# EAGLE schematic smartwatch-top (EAGLE 9.5.1)
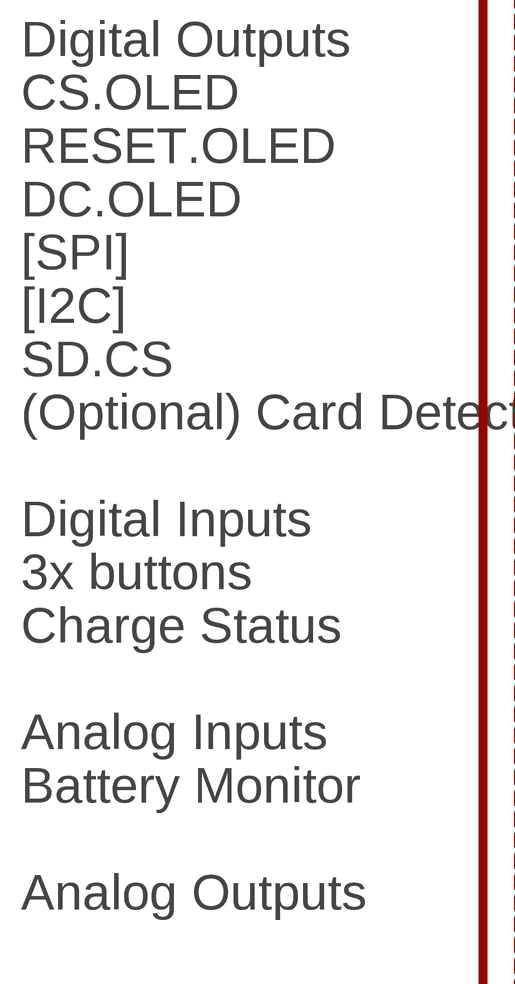
[diagram p0: schematic, sheet 1, part 1 of 2]
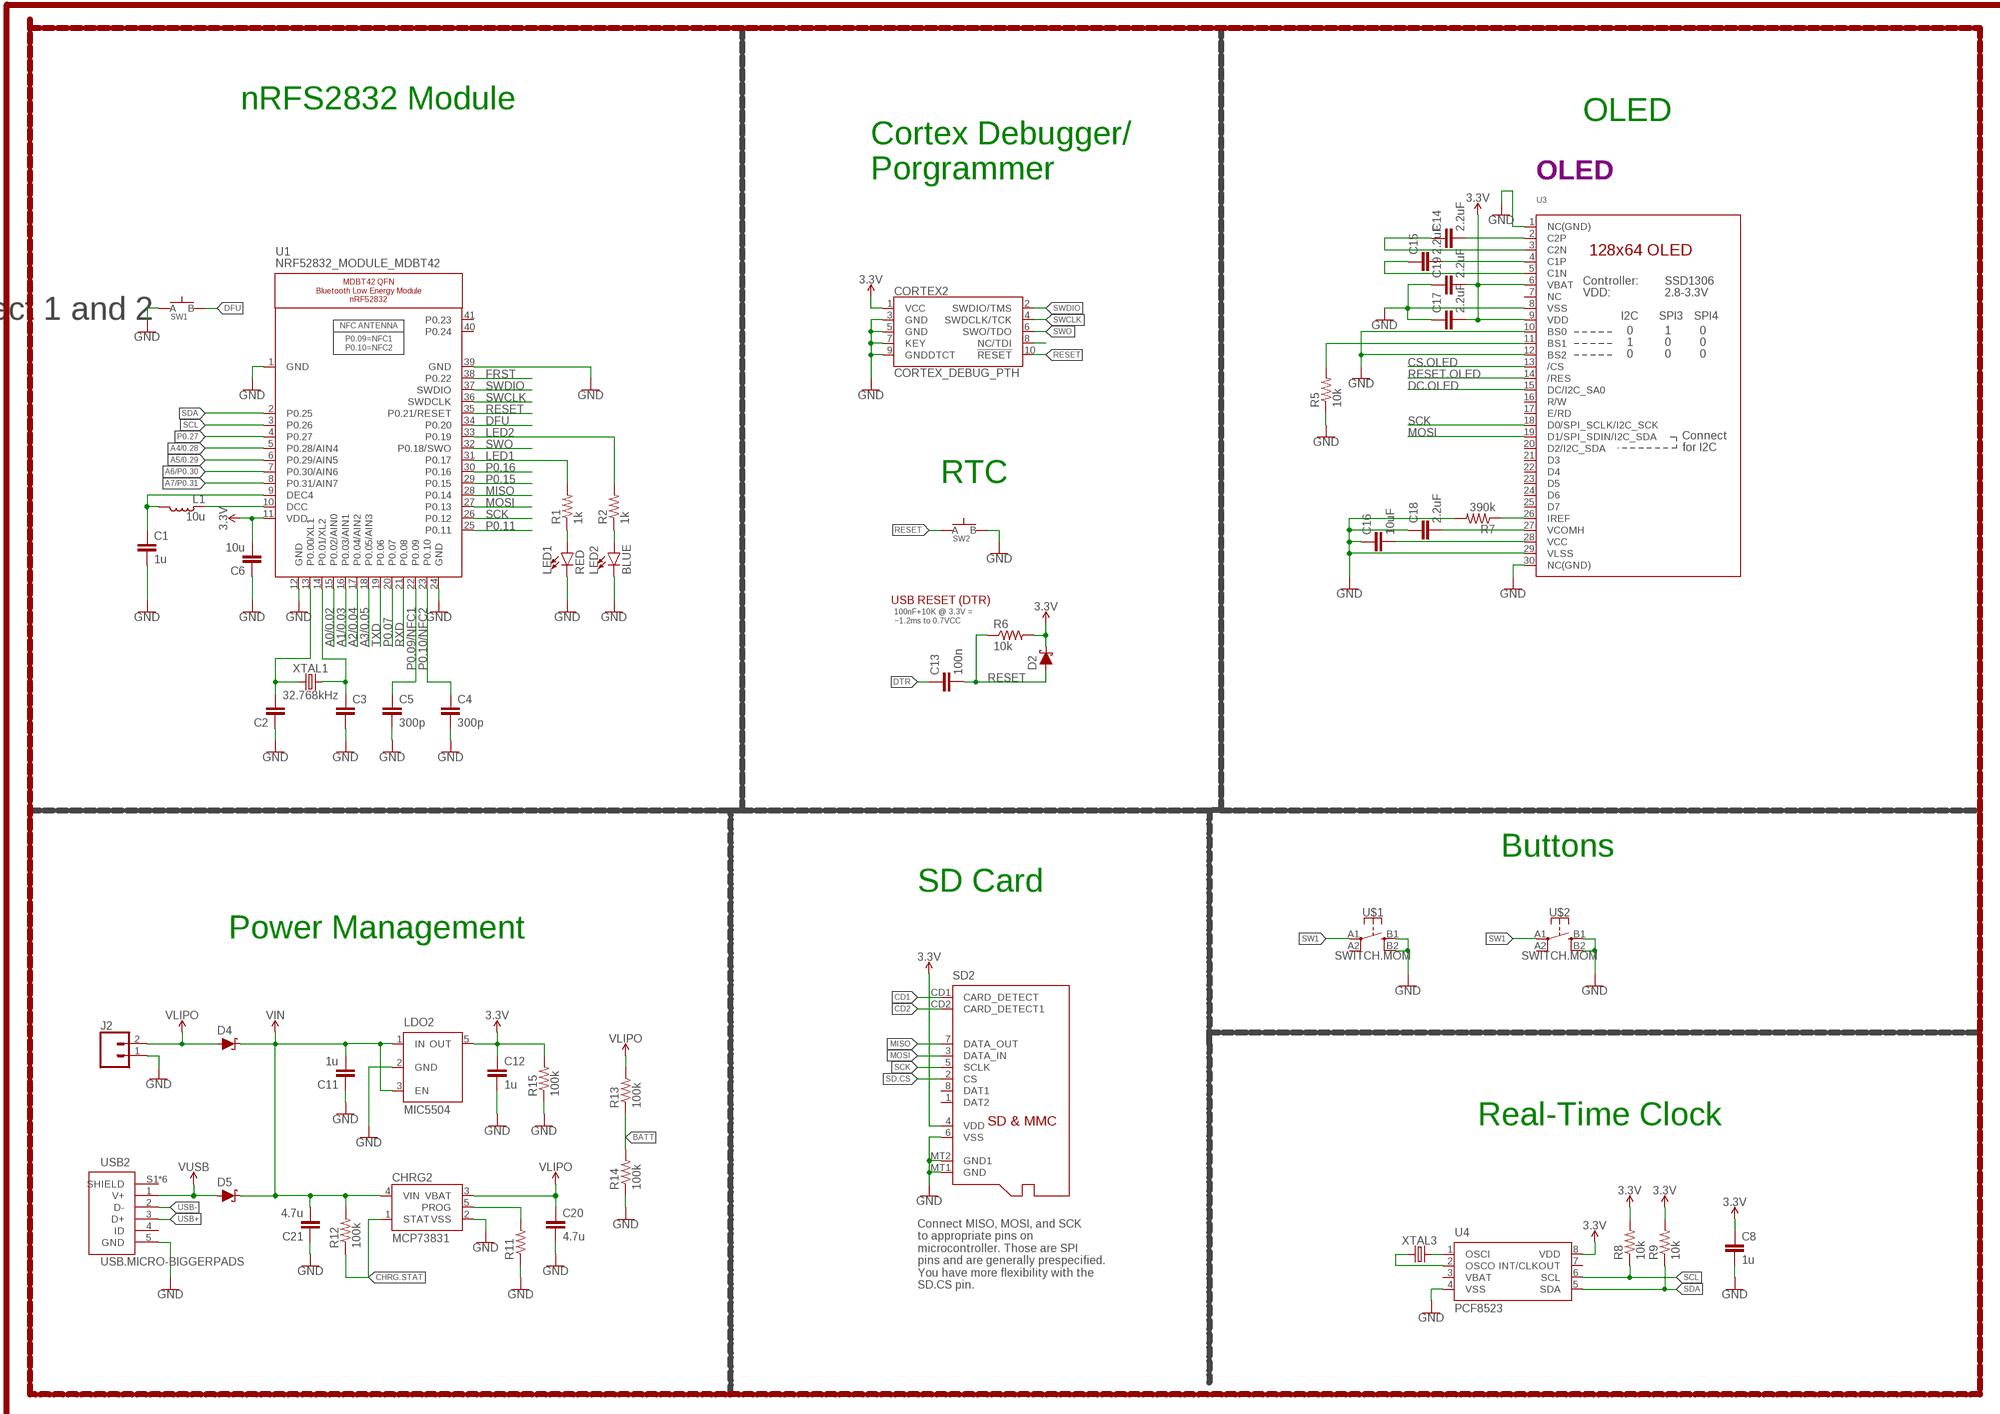
[diagram p1: schematic, sheet 1, part 2 of 2]

## Parts
C1  1u  CAPACITOR0603  [C0603]
C2  CAPACITOR0603  [C0603]
C3  CAPACITOR0603  [C0603]
C4  300p  CAPACITOR0603  [C0603]
C5  300p  CAPACITOR0603  [C0603]
C6  10u  CAPACITOR0805  [C0805]
C8  1u  CAPACITOR0603  [C0603]
C11  1u  CAPACITOR0603  [C0603]
C12  1u  CAPACITOR0603  [C0603]
C13  100n  CAPACITOR0603  [C0603]
C14  2.2uF  CAPACITOR0402  [C0402]
C15  2.2uF  CAPACITOR0402  [C0402]
C16  10uF  CAPACITOR0603  [C0603]
C17  2.2uF  CAPACITOR0402  [C0402]
C18  2.2uF  CAPACITOR0402  [C0402]
C19  2.2uF  CAPACITOR0402  [C0402]
C20  4.7u  CAPACITOR0603  [C0603]
C21  4.7u  CAPACITOR0603  [C0603]
CHRG2  MCP73831  [SOT23-5]
CORTEX2  CORTEX_DEBUG_PTH  [2X5-PTH-1.27MM]
D2  SCHOTTKY-USC  [USC]
D4  SCHOTTKY-USC  [USC]
D5  SCHOTTKY-USC  [USC]
J2  CONN_02  [1X02]
L1  10u  INDUCTOR0603  [L0603]
LDO2  MIC5504  [SOT23-5]
LED1  RED  LED0603  [LED-0603]
LED2  BLUE  LED0603  [LED-0603]
R1  1k  RESISTOR0603  [R0603]
R2  1k  RESISTOR0603  [R0603]
R5  10k  RESISTOR0603  [R0603]
R6  10k  RESISTOR0603  [R0603]
R7  390k  RESISTOR0603  [R0603]
R8  10k  RESISTOR0603  [R0603]
R9  10k  RESISTOR0603  [R0603]
R11  RESISTOR0603  [R0603]
R12  100k  RESISTOR0603  [R0603]
R13  100k  RESISTOR0603  [R0603]
R14  100k  RESISTOR0603  [R0603]
R15  100k  RESISTOR0603  [R0603]
SD2  MICROSD  [MICROSD]
SW1  SPST-PTS830GG140-COPY.1-3  [BUTTON-GULLWING]
SW2  SPST-PTS830GG140-COPY.1-3  [BUTTON-GULLWING]
U1  NRF52832_MODULE_MDBT42  [BLE_MODULE_RAYTAC_MDBT42]
U3  DISP_OLED_UG-2864HSWEG01-NO-WRAPAROUND  [UG-2864HSWEG01_0.96IN_NO-WRAPAROUND]
U4  PCF8523  [SO8]
U$1  SWITCH.MOM  [TACTILE_SWITCH_SMD_6.2MM_TALL]
U$2  SWITCH.MOM  [TACTILE_SWITCH_SMD_6.2MM_TALL]
USB2  USB.MICRO-BIGGERPADS  [USB-MICRO-01.BIGGERPADS]
XTAL1  32.768kHz  CRYSTALECS-.327-12.5-12-C-TR  [2-SMD.NOLEAD.2.0MMTO1.2MM]
XTAL3  CRYSTALECS-.327-12.5-12-C-TR  [2-SMD.NOLEAD.2.0MMTO1.2MM]

## Nets
3.3V: C6.2 C8.1 C12.1 C17.2 C19.2 CORTEX2.1(VCC) D2.-(C) LDO2.5(OUT) R6.2 R8.2 R9.2 R15.2 SD2.4(VDD) U1.11(VDD) U3.6(VBAT) U3.9(VDD) U4.8(VDD)
A0/0.02: U1.15(P0.02/AIN0)
A1/0.03: U1.16(P0.03/AIN1)
A2/0.04: U1.17(P0.04/AIN2)
A3/0.05: U1.18(P0.05/AIN3)
A4/0.28: U1.5(P0.28/AIN4)
A5/0.29: U1.6(P0.29/AIN5)
A6/P0.30: U1.7(P0.30/AIN6)
A7/P0.31: U1.8(P0.31/AIN7)
BATT: R13.1 R14.2
CD1: SD2.CD1(CARD_DETECT)
CD2: SD2.CD2(CARD_DETECT1)
CHRG.STAT: CHRG2.1(STAT) R12.1
CS.OLED: U3.13(/CS)
DC.OLED: U3.15(DC/I2C_SA0)
DFU: SW1.3(B) U1.34(P0.20)
DTR: C13.1
FRST: U1.38(P0.22)
GND: C1.2 C2.1 C3.2 C4.2 C5.2 C6.1 C8.2 C11.1 C12.2 C16.1 C17.1 C18.1 C19.1 C20.2 C21.1 CHRG2.2(VSS) CORTEX2.3(GND) CORTEX2.5(GND) CORTEX2.7(KEY) CORTEX2.9(GNDDTCT) J2.1 LDO2.2(GND) LED1.C LED2.C R5.1 R7.2 R11.1 R14.1 R15.1 SD2.6(VSS) SD2.MT1(GND) SD2.MT2(GND1) SW1.1(A) SW2.3(B) U1.1(GND) U1.12(GND) U1.24(GND) U1.39(GND) U3.1(NC(GND)) U3.8(VSS) U3.10(BS0) U3.12(BS2) U3.29(VLSS) U3.30(NC(GND)) U4.4(VSS) USB2.5(GND)
LED1: R1.2 U1.31(P0.17)
LED2: R2.2 U1.33(P0.19)
MISO: SD2.7(DATA_OUT) U1.28(P0.14)
MOSI: SD2.3(DATA_IN) U1.27(P0.13) U3.19(D1/SPI_SDIN/I2C_SDA)
N$1: C2.2 U1.13(P0.00/XL1) XTAL1.P$1
N$2: C3.1 U1.14(P0.01/XL2) XTAL1.P$2
N$3: L1.1 U1.10(DCC)
N$4: R5.2 U3.11(BS1)
N$5: LED1.A R1.1
N$6: R7.1 U3.26(IREF)
N$7: LED2.A R2.1
N$8: C1.1 L1.2 U1.9(DEC4)
N$9: C14.2 U3.2(C2P)
N$10: C14.1 U3.3(C2N)
N$11: C15.2 U3.4(C1P)
N$12: C15.1 U3.5(C1N)
N$13: CORTEX2.8(NC/TDI)
N$14: C16.2 U3.28(VCC)
N$15: C18.2 U3.27(VCOMH)
N$16: U$1.B1 U$1.B2 U$2.B1 U$2.B2 ; supply symbol labelled GND
N$17: CHRG2.5(PROG) R11.2
N$19: U4.2(OSCO) XTAL3.P$1
N$20: U4.1(OSCI) XTAL3.P$2
P0.07: U1.20(P0.07)
P0.09/NFC1: C5.1 U1.22(P0.09)
P0.10/NFC2: C4.1 U1.23(P0.10)
P0.11: U1.25(P0.11)
P0.15: U1.29(P0.15)
P0.16: U1.30(P0.16)
P0.27: U1.4(P0.27)
RESET: C13.2 CORTEX2.10(!RESET) D2.+(A) R6.1 SW2.1(A) U1.35(P0.21/RESET)
RESET.OLED: U3.14(/RES)
RXD: U1.21(P0.08)
SCK: SD2.5(SCLK) U1.26(P0.12) U3.18(D0/SPI_SCLK/I2C_SCK)
SCL: R8.1 U1.3(P0.26) U4.6(SCL)
SD.CS: SD2.2(CS)
SDA: R9.1 U1.2(P0.25) U4.5(SDA)
SW1: U$1.A1 U$2.A1
SWCLK: CORTEX2.4(SWDCLK/TCK) U1.36(SWDCLK)
SWDIO: CORTEX2.2(SWDIO/TMS) U1.37(SWDIO)
SWO: CORTEX2.6(SWO/TDO) U1.32(P0.18/SWO)
TXD: U1.19(P0.06)
USB+: USB2.3(D+)
USB-: USB2.2(D-)
V_USB: D5.+(A) USB2.1(V+) ; supply symbol labelled VUSB
VIN: C11.2 C21.2 CHRG2.4(VIN) D4.-(C) D5.-(C) LDO2.1(IN) LDO2.3(EN) R12.2
VLIPO: C20.1 CHRG2.3(VBAT) D4.+(A) J2.2 R13.2
Unconnected: SD2.1(DAT2) SD2.8(DAT1) U1.40(P0.24) U1.41(P0.23) U3.7(NC) U3.16(R/W) U3.17(E/RD) U3.20(D2/I2C_SDA) U3.21(D3) U3.22(D4) U3.23(D5) U3.24(D6) U3.25(D7) U4.7(INT/CLKOUT) U$1.A2 U$2.A2 USB2.4(ID) USB2.S1(SHIELD) USB2.S2(SHIELD) USB2.S3(SHIELD) USB2.S4(SHIELD) USB2.S5(SHIELD) USB2.S6(SHIELD)

## Notes on the sheet
- nRFS2832 Module
- OLED
- Cortex Debugger/
  Porgrammer
- OLED
- RTC
- USB RESET (DTR)
- 100nF+10K @ 3.3V =
  ~1.2ms to 0.7VCC
- Digital Outputs
  CS.OLED
  RESET.OLED
  DC.OLED
  [SPI]
  [I2C]
  SD.CS
  (Optional) Card Detect 1 and 2
  
  Digital Inputs
  3x buttons
  Charge Status
  
  Analog Inputs
  Battery Monitor
  
  Analog Outputs
- Buttons
- SD Card
- Power Management
- Real-Time Clock
- Connect MISO, MOSI, and SCK
  to appropriate pins on
  microcontroller. Those are SPI
  pins and are generally prespecified.
  You have more flexibility with the
  SD.CS pin.

## Power pins joined to a net without a drawn wire
VBAT: U4.3(VBAT)

## Library data of the parts
C1-C6 C8 C11-C21 = LinnesLab-Passives:CAPACITOR
CHRG2 = LinnesLab-Power:MCP73831: MCP73831T Li-Ion, Li-Pol Controller Miniature single cell, fully integrated Li-Ion, Li-polymer charge management controller Datasheet <http://ww1.microchip.com/downloads/en/DeviceDoc/20001984g.pdf> SparkFun Products: SparkFun ESP32 Thing <https://www.sparkfun.com/products/13907> SparkFun 9DoF Razor IMU M0 <https://www.sparkfun.com/products/14001>; PROD_ID: IC-09995
CORTEX2 = LinnesLab-Connectors:CORTEX_DEBUG: Cortex Debug Connector - 10 pin Supports JTAG debug, Serial Wire debug, and Serial Wire Viewer. PTH and SMD connector options available. General Connector Information <http://infocenter.arm.com/help/topic/com.arm.doc.faqs/attached/13634/cortex_debug_connectors.pdf> Products: PTH Connector <http://www.digikey.com/product-detail/en/cnc-tech/3220-10-0100-00/1175-1627-ND/3883661> -via Digi-Key SparkFun PSoc <https://www.sparkfun.com/products/13229> SparkFun T <https://www.sparkfun.com/products/13810>
D2 D4 D5 = LinnesLab-DiscreteSemi:SCHOTTKY: Schottky diode A Schottky diode is a semiconductor diode which has a low forward voltage drop and a very fast switching action. Example: Digi-Key Part Number: RB161MM-20CT-ND
J2 = LinnesLab-Connectors:CONN_02: Multi connection point. Often used as Generic Header-pin footprint for 0.1 inch spaced/style header connections On any of the 0.1 inch spaced packages, you can populate with these: Break Away Headers - Straight <https://www.sparkfun.com/products/116> (PRT-00116) Break Away Male Headers - Right Angle <https://www.sparkfun.com/products/553> (PRT-00553) Female Headers <https://www.sparkfun.com/products/115> (PRT-00115) Break Away Headers - Machine Pin <https://www.sparkfun.com/products/117> (PRT-00117) Break Away Female Headers - Swiss Machine Pin <https://www.sparkfun.com/products/743> (PRT-00743) For SCREWTERMINALS and SPRING TERMINALS visit here: Screw Terimnals on SparkFun.com <https://www.sparkfun.com/search/results?term=Screw+Terminals> (5mm/3.5mm/2.54mm spacing) This device is also useful as a general connection point to wire up your design to another part of your project. Our various solder wires solder well into these plated through hole pads. Hook-Up Wire - Assortment (Stranded, 22 AWG) <https://www.sparkfun.com/products/11375> (PRT-11375) Hook-Up Wire - Assortment (Solid Core, 22 AWG) <https://www.sparkfun.com/products/11367> (PRT-11367) View the entire wire category on our website here <https://www.sparkfun.com/categories/141> Special notes: Molex polarized connector foot print use with: PRT-08233 with associated crimp pins and housings. 2.54_SCREWTERM for use with PRT-10571. 3.5mm Screw Terminal footprints for PRT-08084 5mm Screw Terminal footprints for use with PRT-08432
L1 = LinnesLab-Passives:INDUCTOR
LDO2 = LinnesLab-Power:MIC5504: MIC5504 Voltage Regulator Output Voltages: 1.0V to 3.3V Input Voltages: 2.5V to 5.5V Link to Datasheet http://ww1.microchip.com/downloads/en/DeviceDoc/MIC550X.pdf
LED1 LED2 = LinnesLab-LED:LED: LED (Generic) Standard schematic elements and footprints for 5mm, 3mm, 1206, and 0603 sized LEDs. Generic LEDs with no color specified. LTST-C190KGKT: arrow indicates cathode
R1 R2 R5-R9 R11-R15 = LinnesLab-Passives:RESISTOR
SD2 = LinnesLab-Connectors:MICROSD: Micro-SD / Transflash card holder with SPI pinout For the 3M # 2908-05WB-MG and/or 4UCON #19656 push-push type
SW1 SW2 = LinnesLab-Switches:SPST-PTS830GG140-COPY
U1 = LinnesLab-Microcontrollers:NRF52832_MODULE_MDBT42: MDBT42 - BLE Module (nRF52832 QFN) VDD: 1.7-3.6V
U3 = LinnesLab-Displays:DISP_OLED_UG-2864HSWEG01: UG-2864HSWEG01 OLED display Both 1.3" and 0.96" models share the same FPC tab footprint, only the screen dimensions vary.
U4 = LinnesLab-Clocks:PCF8523
U$1 U$2 = LinnesLab-Switches:SWITCH.MOM: PTS645SM43SMTR92 LFS
USB2 = LinnesLab-Connectors:USB.MICRO: DigiKey PN: 609-4613-1-ND
XTAL1 XTAL3 = LinnesLab-Clocks:CRYSTAL